# EasyEDA Pro project ProPrj_TPA3156_EASYEDA.epro, schematic Schematic1
Board Name: Board1; Create Date: 2024-09-04; Page Name: P1; Project Name: TPA3156 Amplifire; Schematic Name: Schematic1; Update Date: 2024-09-26; Company: EasyEDA.com; Drawn: EasyEDA; Page Size: A4; Part Number: JLCPCB-002; Reviewed: EasyEDA; Version: V0.1
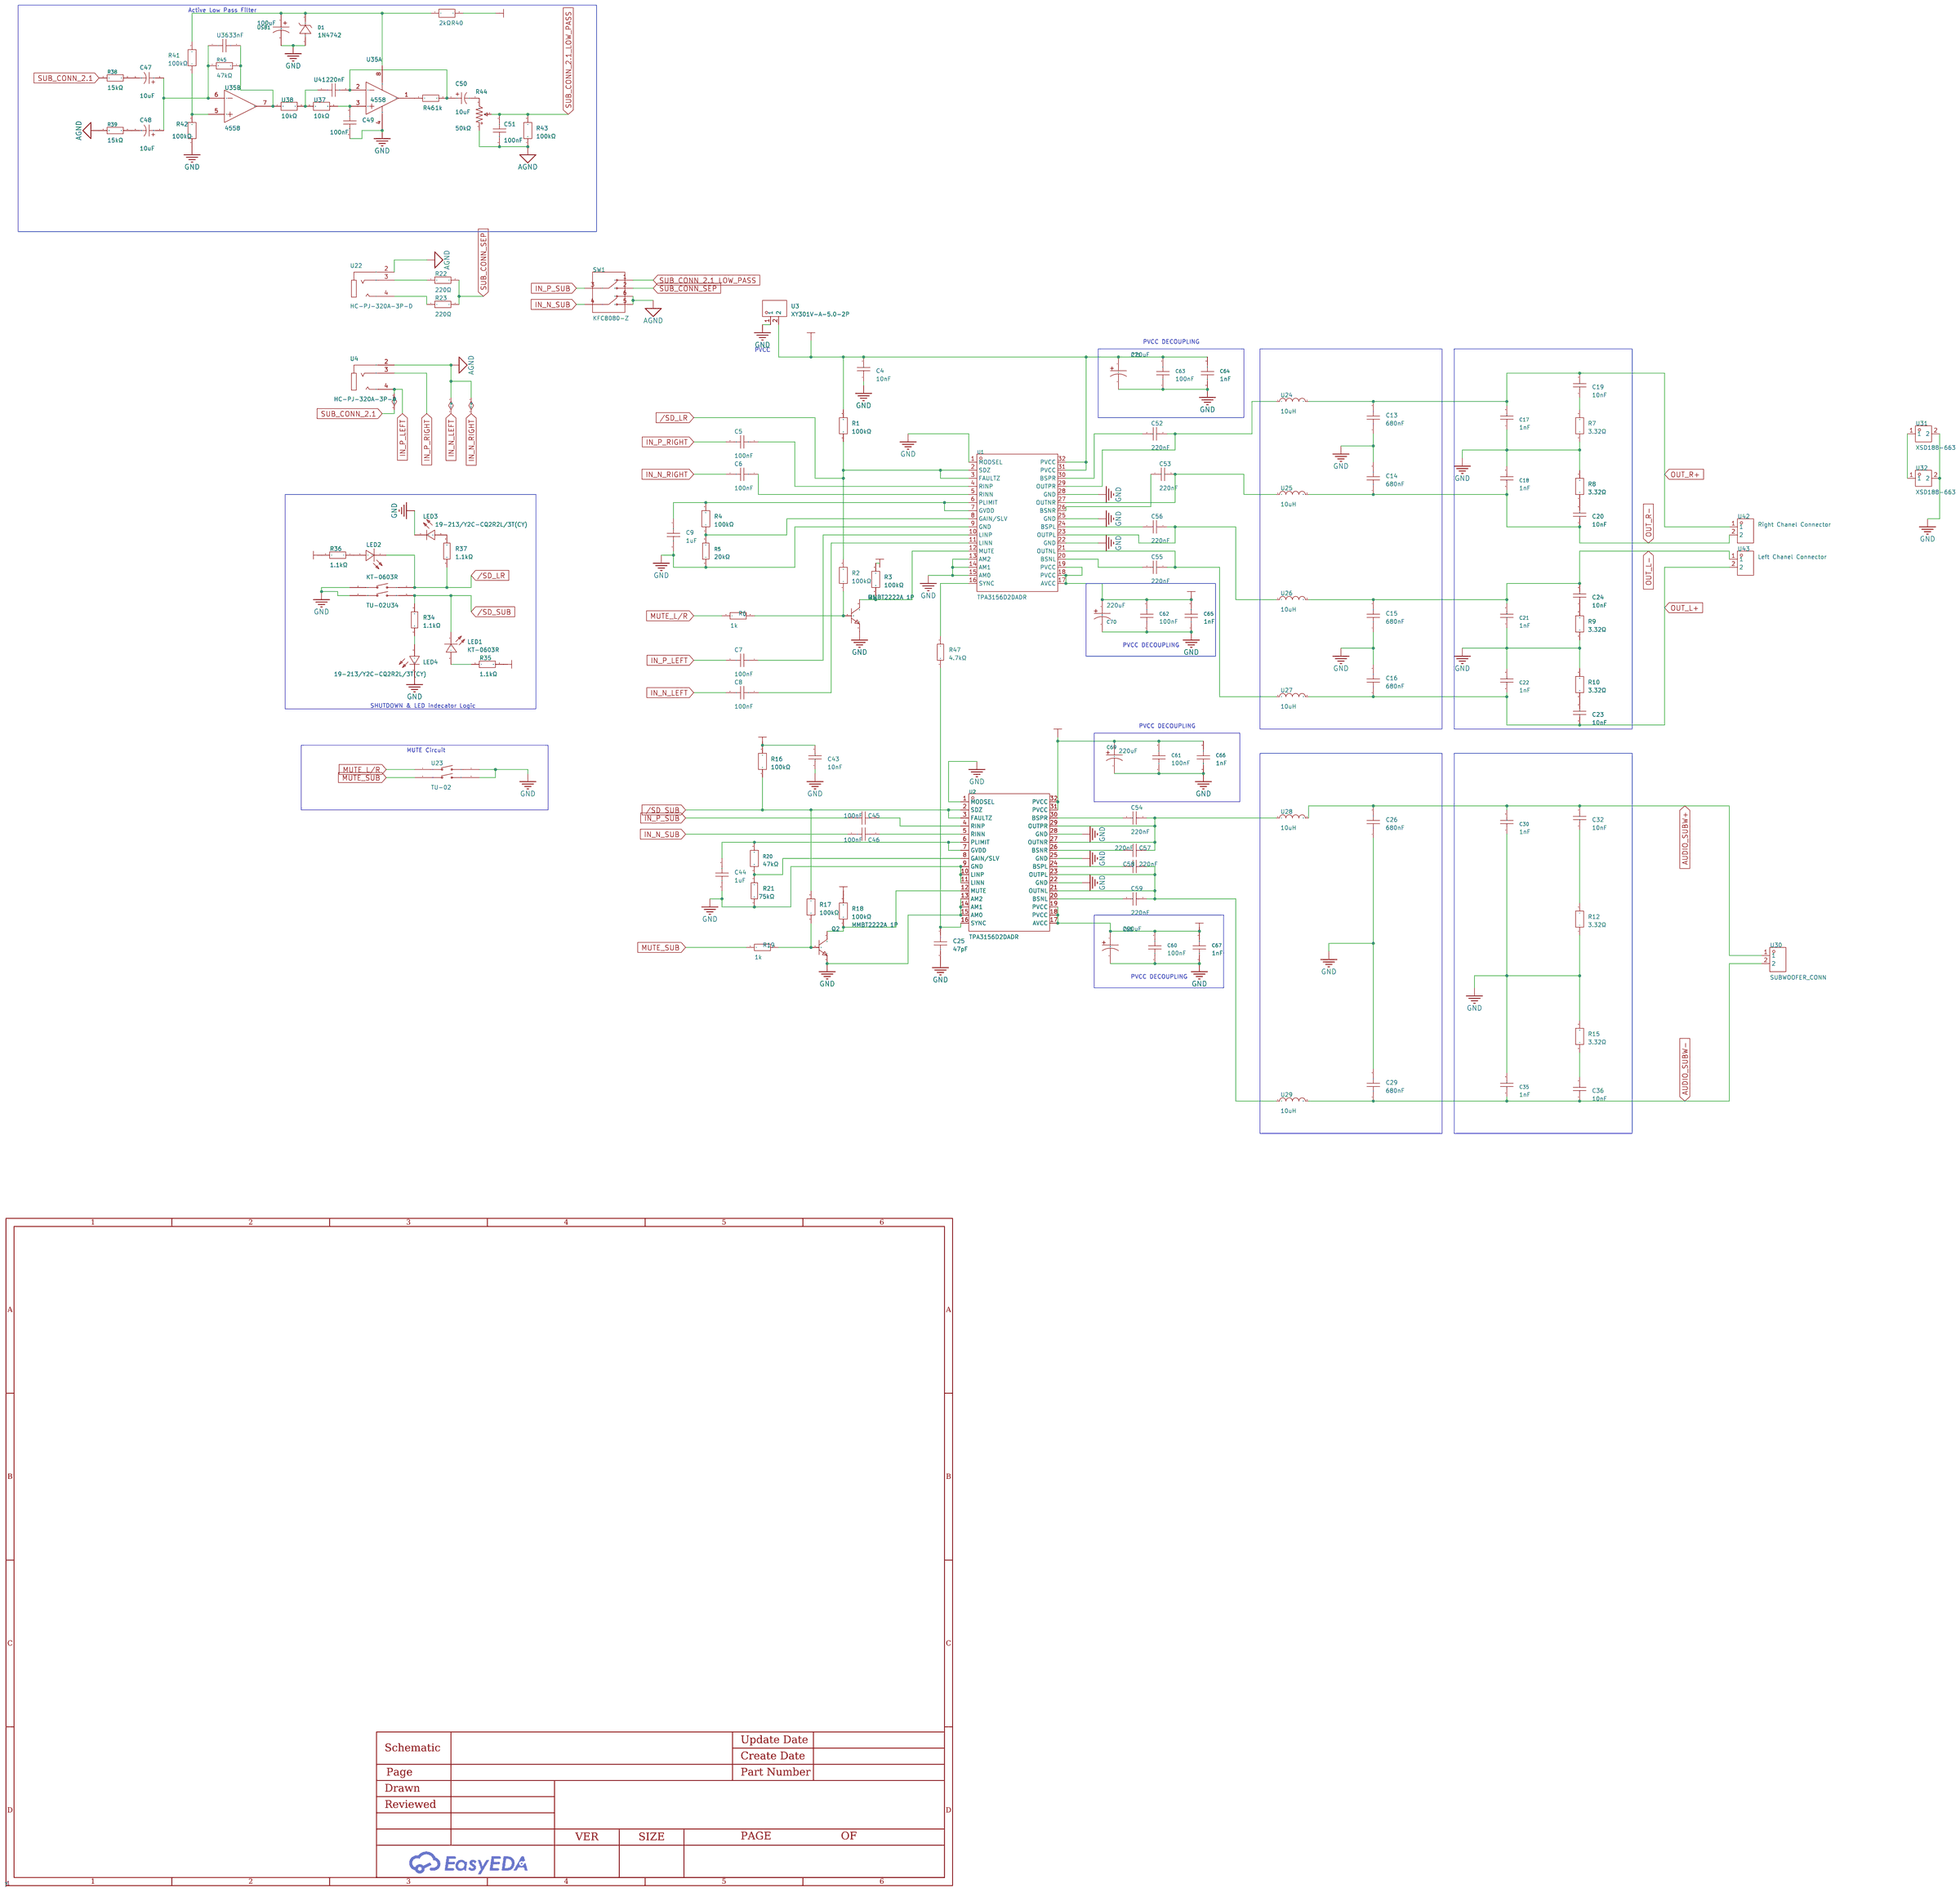
[diagram p0: schematic sheet]

## Parts
C4  10nF  [C0805]
C5  100nF  [C0603]
C6  100nF  [C0603]
C7  100nF  [C0603]
C8  100nF  [C0603]
C9  1uF  [C0603]
C13  680nF  [C1206]
C14  680nF  [C1206]
C15  680nF  [C1206]
C16  680nF  [C1206]
C17  1nF  [C0603]
C18  1nF  [C0603]
C19  10nF  [C0805]
C20  10nF  [C0805]
C21  1nF  [C0603]
C22  1nF  [C0603]
C23  10nF  [C0805]
C24  10nF  [C0805]
C25  47pF  [C0201]
C26  680nF  [C1206]
C29  680nF  [C1206]
C30  1nF  [C0603]
C32  10nF  [C0805]
C35  1nF  [C0603]
C36  10nF  [C0805]
C43  10nF  [C0805]
C44  1uF  [C0603]
C45  100nF  [C0603]
C46  100nF  [C0603]
C47  10uF  [CAP-SMD_L2.0-W1.3-FD]
C48  10uF  [CAP-SMD_L2.0-W1.3-FD]
C49  100nF  [C0603]
C50  10uF  [CAP-SMD_L2.0-W1.3-FD]
C51  100nF  [C0603]
C52  220nF  [C0603]
C53  220nF  [C0603]
C54  220nF  [C0603]
C55  220nF  [C0603]
C56  220nF  [C0603]
C57  220nF  [C0603]
C58  220nF  [C0603]
C59  220nF  [C0603]
C60  100nF  [C0603]
C61  100nF  [C0603]
C62  100nF  [C0603]
C63  100nF  [C0603]
C64  1nF  [C0603]
C65  1nF  [C0603]
C66  1nF  [C0603]
C67  1nF  [C0603]
C68  220uF  [CAP-TH_BD10.0-P5.00-D1.0-FD]
C69  220uF  [CAP-TH_BD10.0-P5.00-D1.0-FD]
C70  220uF  [CAP-TH_BD10.0-P5.00-D1.0-FD]
C71  220uF  [CAP-TH_BD10.0-P5.00-D1.0-FD]
D1  1N4742  [DO-41_BD2.4-L4.7-P8.70-D0.8-FD]
LED1  KT-0603R  [LED0603-RD]
LED2  KT-0603R  [LED0603-RD]
LED3  19-213/Y2C-CQ2R2L/3T(CY)  [LED0603-RD-YELLOW]
LED4  19-213/Y2C-CQ2R2L/3T(CY)  [LED0603-RD-YELLOW]
Q1  MMBT2222A 1P  [SOT-23-3_L2.9-W1.3-P1.90-LS2.4-BR]
Q2  MMBT2222A 1P  [SOT-23-3_L2.9-W1.3-P1.90-LS2.4-BR]
R1  100kΩ  [R1206]
R2  100kΩ  [R1206]
R3  100kΩ  [R1206]
R4  100kΩ  [R1206]
R5  20kΩ  [R0603]
R6  1k  [R0603]
R7  3.32Ω  [R0201]
R8  3.32Ω  [R0201]
R9  3.32Ω  [R0201]
R10  3.32Ω  [R0201]
R12  3.32Ω  [R0201]
R15  3.32Ω  [R0201]
R16  100kΩ  [R1206]
R17  100kΩ  [R1206]
R18  100kΩ  [R1206]
R19  1k  [R0603]
R20  47kΩ  [R0805]
R21  75kΩ  [R0805]
R22  220Ω  [R0805]
R23  220Ω  [R0805]
R34  1.1kΩ  [R0603]
R35  1.1kΩ  [R0603]
R36  1.1kΩ  [R0603]
R37  1.1kΩ  [R0603]
R38  15kΩ  [R0402]
R39  15kΩ  [R0402]
R40  2kΩ  [R0805]
R41  100kΩ  [R0805]
R42  100kΩ  [R0805]
R43  100kΩ  [R0805]
R44  50kΩ  [RES-ADJ-TH_3P-L9.5-W4.85-P2.50-BL-BS]
R45  47kΩ  [R0603]
R46  1k  [R0603]
R47  4.7kΩ  [R0402]
SW1  KFC8080-Z  [SW-TH_6P-L8.0-W8.0-P2.50]
U1  TPA3156D2DADR  [HTSSOP-32_L11.0-W6.1-P0.65-LS8.1-BL]
U2  TPA3156D2DADR  [HTSSOP-32_L11.0-W6.1-P0.65-LS8.1-BL]
U3  XY301V-A-5.0-2P  [CONN-TH_XY301V-A-5.0-2P]
U4  HC-PJ-320A-3P-D  [AUDIO-TH_HC-PJ-320A-3P-D]
U22  HC-PJ-320A-3P-D  [AUDIO-TH_HC-PJ-320A-3P-D]
U23  TU-02  [SW-SMD_4P-P1.27-L4.2-W5.4]
U24  10uH  [IND-SMD_L13.2-W12.9_MMD-12FD]
U25  10uH  [IND-SMD_L13.2-W12.9_MMD-12FD]
U26  10uH  [IND-SMD_L13.2-W12.9_MMD-12FD]
U27  10uH  [IND-SMD_L13.2-W12.9_MMD-12FD]
U28  10uH  [IND-SMD_L13.2-W12.9_MMD-12FD]
U29  10uH  [IND-SMD_L13.2-W12.9_MMD-12FD]
U30  SUBWOOFER_CONN  [CONN-TH_XY301V-A-5.0-2P]
U31  XSD188-663  [HEATSINK-SMD_XSD188-663]
U32  XSD188-663  [HEATSINK-SMD_XSD188-663]
U34  TU-02  [SW-SMD_4P-P1.27-L4.2-W5.4]
U35  4558  [SOP-8_L5.0-W4.0-P1.27-LS6.0-BL]  (sections 1,2)
U36  33nF  [C0402]
U37  10kΩ  [R0603]
U38  10kΩ  [R0603]
U41  220nF  [C0201]
U42  Right Chanel Connector  [CONN-TH_XY301V-A-5.0-2P]
U43  Left Chanel Connector  [CONN-TH_XY301V-A-5.0-2P]
USB1  100uF  [CAP-TH_BD8.0-P3.50-D0.6-FD_1]

## Library data of the parts
C4 C19 C20 C23 C24 C32 C36 C43 = CL21B103KBANNNC: Capacitance: Tolerance:±10% Tolerance:±10% Voltage Rated: Temperature Coefficient:; LCSC Part Name: 10nF ±10% 50V; Supplier Part: C1710; Manufacturer: SAMSUNG(三星); Supplier Footprint: 0805; JLCPCB Part Class: Basic Part; Datasheet: https://atta.szlcsc.com/upload/public/pdf/source/20160218/1457707763339.pdf; Supplier: LCSC; Tolerance: ±10%
C5-C9 C44-C46 C49 C51 = CAP_0603: Supplier Footprint: 0603
C13-C16 C26 C29 = 12065C684KAT2A: Capacitance: Tolerance:±10% Tolerance:±10% Voltage Rated: Temperature Coefficient:; LCSC Part Name: 680nF ±10% 50V; Supplier Part: C597526; Manufacturer: Kyocera AVX; Supplier Footprint: 1206; JLCPCB Part Class: Extended Part; Datasheet: https://atta.szlcsc.com/upload/public/pdf/source/20200615/C597466_43C0ECAE328FD9290913677CF18D6AC0.pdf; Supplier: LCSC; Tolerance: ±10%
C17 C18 C21 C22 C30 C35 = CL10B102KB8NNNC: Capacitance: Tolerance:±10% Tolerance:±10% Voltage Rated: Temperature Coefficient:; LCSC Part Name: 1nF ±10% 50V; Supplier Part: C1588; Manufacturer: SAMSUNG(三星); Supplier Footprint: 0603; Datasheet: https://atta.szlcsc.com/upload/public/pdf/source/20160218/1457707763339.pdf; Supplier: LCSC; Tolerance: ±10%
C25 = C0603C0G1E470J030BA: Capacitance: Tolerance:±5% Tolerance:±5% Voltage Rated: Temperature Coefficient:; LCSC Part Name: 47pF ±5% 25V; Supplier Part: C2182698; Manufacturer: TDK; Supplier Footprint: 0201; JLCPCB Part Class: Extended Part; Datasheet: https://atta.szlcsc.com/upload/public/pdf/source/20210430/12912E3792F621391F28022904E5A4A4.pdf; Supplier: LCSC; Tolerance: ±5%
C47 C48 C50 = CA45A-P-6.3V-10UF-K: Capacitance: Tolerance:±10% Tolerance:±10% Rated Voltage: Operating Temperature:-55℃~+125℃ Operating Temperature:-55℃~+125℃; LCSC Part Name: 10uF ±10% 6.3V; Supplier Part: C2976905; Manufacturer: CEC(振华新云); Supplier Footprint: SMD,1.25x2mm; JLCPCB Part Class: Extended Part; Datasheet: https://atta.szlcsc.com/upload/public/pdf/source/20220222/C2C5F368BEBB90E653B4407F98E5644A.pdf; Supplier: LCSC; Tolerance: ±10%; Operating Temperature: -55℃~+125℃
C52-C59 = GRM188R71E224KA88D: Capacitance: Tolerance:±10% Tolerance:±10% Voltage Rated: Temperature Coefficient:; LCSC Part Name: 220nF ±10% 25V; Supplier Part: C77051; Manufacturer: muRata(村田); Supplier Footprint: 0603; Datasheet: https://atta.szlcsc.com/upload/public/pdf/source/20200305/C490387_23319AE8C154DEB24C505E6C82A8106A.pdf; Supplier: LCSC; Tolerance: ±10%
C60-C63 = GCM188R71H104KA57D: Capacitance: Tolerance:±10% Tolerance:±10% Voltage Rated: Temperature Coefficient:; LCSC Part Name: 100nF ±10% 50V; Supplier Part: C85864; Manufacturer: muRata(村田); Supplier Footprint: 0603; JLCPCB Part Class: Extended Part; Datasheet: https://atta.szlcsc.com/upload/public/pdf/source/20161104/1478252919844.pdf; Supplier: LCSC; Tolerance: ±10%
C64-C67 = GRM1885C1H102JA01D: Capacitance: Tolerance:±5% Tolerance:±5% Voltage Rated: Temperature Coefficient:; LCSC Part Name: 1nF ±5% 50V; Supplier Part: C77026; Manufacturer: muRata(村田); Supplier Footprint: 0603; JLCPCB Part Class: Extended Part; Datasheet: https://atta.szlcsc.com/upload/public/pdf/source/20200305/C490387_23319AE8C154DEB24C505E6C82A8106A.pdf; Supplier: LCSC; Tolerance: ±5%
C68-C71 = EEUFC1V221B: Capacitance: Tolerance:±20% Tolerance:±20% Rated Voltage: Ripple Current:755mA@100kHz Equivalent Series Resistance(ESR):90mΩ@100kHz Lead Spacing: φD: L: Lifetime @ Temp:3000hrs@105℃ Operating Temperature:-55℃~+105℃ Operating Temperature:-55℃~+105℃; LCSC Part Name: 220uF ±20% 35V; Supplier Part: C178681; Manufacturer: PANASONIC(松下); Supplier Footprint: 插件,D10xL12.5mm; JLCPCB Part Class: Extended Part; Datasheet: https://atta.szlcsc.com/upload/public/pdf/source/20181222/C178681_6E15EF82E6D495A72D0777BE3B4ACA7A.pdf; Supplier: LCSC; Tolerance: ±20%; Ripple Current: 755mA@100kHz; Equivalent Series Resistance(ESR): 90mΩ@100kHz; Lifetime @ Temp: 3000hrs@105℃; Operating Temperature: -55℃~+105℃
D1 = 1N4742: Diode Configuration:Single Zener Voltage (Nom):12V Reverse Leakage Current (Ir):3uA Zener Voltage (Range):11.45V~12.95V Zener Voltage (Range):11.45V~12.95V Power Dissipation:1W Zener Impedance (Zzt):9Ω Tolerance:±5% Tolerance:±5%; Supplier Part: C5174492; Manufacturer: LGE(鲁光); Supplier Footprint: DO-41; JLCPCB Part Class: Extended Part; Datasheet: https://atta.szlcsc.com/upload/public/pdf/source/20220915/859F92BB52C22EFA9D12B90684DCEAFE.pdf; Supplier: LCSC; Diode Configuration: Single; Zener Voltage (Nom): 12V; Reverse Leakage Current (Ir): 3uA; Zener Voltage (Range): 11.45V~12.95V; Power Dissipation: 1W; Zener Impedance (Zzt): 9Ω; Tolerance: ±5%
LED1 LED2 = KT-0603R: Emitted Color:Red Power Dissipation:- Forward Current:- Dominant Wavelength:- Dominant Wavelength:- Peak Wavelength:- Diode Configuration:- Lens Color:- Color Temperature:- Color Temperature:- Viewing Angle:- Mounting Sytle:- Operating Temperature:-40℃~+8; LCSC Part Name: 0603 红灯 高亮; Supplier Part: C2286; Manufacturer: KENTO; Supplier Footprint: 0603; JLCPCB Part Class: Basic Part; Datasheet: https://atta.szlcsc.com/upload/public/pdf/source/20160616/1466072038404.pdf; Supplier: LCSC; Emitted Color: Red; Operating Temperature: -40℃~+85℃
LED3 LED4 = 19-213/Y2C-CQ2R2L/3T(CY): Emitted Color:Yellow Power Dissipation:60mW Forward Current:20mA Dominant Wavelength:585.5nm~591.5nm Dominant Wavelength:585.5nm~591.5nm Peak Wavelength:591nm Diode Configuration:- Lens Color:无色透明透镜 Color Temperature:- Color Temperature:- Viewing Angle:12; LCSC Part Name: 黄灯; Supplier Part: C72038; Manufacturer: EVERLIGHT(亿光); Supplier Footprint: 0603; JLCPCB Part Class: Basic Part; Datasheet: https://atta.szlcsc.com/upload/public/pdf/source/20160507/1462613613586.pdf; Supplier: LCSC; Emitted Color: Yellow; Power Dissipation: 60mW; Forward Current: 20mA; Dominant Wavelength: 585.5nm~591.5nm; Peak Wavelength: 591nm; Lens Color: 无色透明透镜; Viewing Angle: 120°; Operating Temperature: -40℃~+85℃
Q1 Q2 = MMBT2222A 1P: Transistor Type: Collector Current (Ic): Collector-Emitter Breakdown Voltage (Vceo): Power Dissipation (Pd): Transition Frequency (fT):300MHz Collector Cut-Off Current (Icbo):10nA Collector-Emitter Saturation Voltage (VCE(sat)@Ic,Ib):1V@500mA,50mA Operati; LCSC Part Name: NPN 电流:600mA 耐压:40V 丝印1P; Supplier Part: C8512; Manufacturer: CJ(江苏长电/长晶); Supplier Footprint: SOT-23; JLCPCB Part Class: Basic Part; Datasheet: https://atta.szlcsc.com/upload/public/pdf/source/20140815/1457707223705.pdf; Supplier: LCSC; Transition Frequency (fT): 300MHz; Collector Cut-Off Current (Icbo): 10nA; Collector-Emitter Saturation Voltage (VCE(sat)@Ic,Ib): 1V@500mA,50mA
R1-R4 R16-R18 = RNCS1206BKE100K: Type:Thin Film Resistor Resistance: Tolerance:±0.1% Tolerance:±0.1% Power(Watts): Overload Voltage (Max): Temperature Coefficient:±25ppm/℃ Temperature Coefficient:±25ppm/℃ Operating Temperature Range:-55℃~+155℃ Operating Temperature Range:-55℃~+155℃; LCSC Part Name: 薄膜电阻 100kΩ ±0.1% 125mW; Supplier Part: C346663; Manufacturer: SEI(Stackpole Electronics Inc.); Supplier Footprint: 1206; JLCPCB Part Class: Extended Part; Datasheet: https://atta.szlcsc.com/upload/public/pdf/source/20190312/C346690_015790D0191F715BE190A3F714156E39.pdf; Supplier: LCSC; Type: Thin Film Resistor; Tolerance: ±0.1%; Temperature Coefficient: ±25ppm/℃; Operating Temperature Range: -55℃~+155℃
R5 = 0603WAF2002T5E: Type:Thick Film Resistors Resistance:20kΩ Tolerance:±1% Tolerance:±1% Power(Watts): Overload Voltage (Max): Temperature Coefficient:±100ppm/℃ Temperature Coefficient:±100ppm/℃ Operating Temperature Range:-55℃~+155℃ Operating Temperature Range:-55℃~+155℃; LCSC Part Name: 20kΩ ±1% 100mW 厚膜电阻; Supplier Part: C4184; Manufacturer: UNI-ROYAL(厚声); Supplier Footprint: 0603; Datasheet: https://atta.szlcsc.com/upload/public/pdf/source/20200306/C422600_1E6D84923E4A46A82E41ADD87F860B5C.pdf; Supplier: LCSC; Type: Thick Film Resistors; Tolerance: ±1%; Temperature Coefficient: ±100ppm/℃; Operating Temperature Range: -55℃~+155℃
R6 R19 R46 = Res_0603: Supplier Footprint: 0603
R7-R10 R12 R15 = 0201WMF332KTEE: Type:Thick Film Resistors Resistance:3320mΩ Tolerance:±1% Tolerance:±1% Power(Watts): Overload Voltage (Max): Temperature Coefficient:-100ppm/℃~+350ppm/℃ Temperature Coefficient:-100ppm/℃~+350ppm/℃ Operating Temperature Range:-55℃~+155℃ Operating Temperat; LCSC Part Name: 3.32Ω ±1% 50mW 厚膜电阻; Supplier Part: C423576; Manufacturer: UNI-ROYAL(厚声); Supplier Footprint: 0201; Datasheet: https://atta.szlcsc.com/upload/public/pdf/source/20200306/C422600_1E6D84923E4A46A82E41ADD87F860B5C.pdf; Supplier: LCSC; Type: Thick Film Resistors; Tolerance: ±1%; Temperature Coefficient: -100ppm/℃~+350ppm/℃; Operating Temperature Range: -55℃~+155℃
R20 = ERA6VEB4702V: Type:Thin Film Resistor Resistance:47kΩ Tolerance:±0.1% Tolerance:±0.1% Power(Watts): Temperature Coefficient:±25ppm/℃ Temperature Coefficient:±25ppm/℃ Operating Temperature Range:-55℃~+155℃ Operating Temperature Range:-55℃~+155℃; LCSC Part Name: 47kΩ ±0.1% 250mW 薄膜电阻; Supplier Part: C490805; Manufacturer: PANASONIC(松下); Supplier Footprint: 0805; JLCPCB Part Class: Extended Part; Datasheet: https://atta.szlcsc.com/upload/public/pdf/source/20200407/C490805_3A20CAE3CE075CA1D6BE6B79E40105B5.pdf; Supplier: LCSC; Type: Thin Film Resistor; Tolerance: ±0.1%; Temperature Coefficient: ±25ppm/℃; Operating Temperature Range: -55℃~+155℃
R21 = RT0805BRD0775KL: Type:Thin Film Resistor Resistance: Tolerance:±0.1% Tolerance:±0.1% Power(Watts): Overload Voltage (Max): Temperature Coefficient:±25ppm/℃ Temperature Coefficient:±25ppm/℃ Operating Temperature Range:-55℃~+155℃ Operating Temperature Range:-55℃~+155℃; LCSC Part Name: 薄膜电阻 75kΩ ±0.1% 125mW; Supplier Part: C136919; Manufacturer: YAGEO(国巨); Supplier Footprint: 0805; JLCPCB Part Class: Extended Part; Datasheet: https://atta.szlcsc.com/upload/public/pdf/source/20181009/C309664_C7CEF5A7F4D0541F96EF5E54D941D229.pdf; Supplier: LCSC; Type: Thin Film Resistor; Tolerance: ±0.1%; Temperature Coefficient: ±25ppm/℃; Operating Temperature Range: -55℃~+155℃
R22 R23 = RN732ATTD2200B25: Type:Thin Film Resistor Resistance: Tolerance:±0.1% Tolerance:±0.1% Power(Watts): Overload Voltage (Max): Temperature Coefficient:±25ppm/℃ Temperature Coefficient:±25ppm/℃ Operating Temperature Range:-55℃~+155℃ Operating Temperature Range:-55℃~+155℃; LCSC Part Name: 薄膜电阻 220Ω ±0.1% 100mW; Supplier Part: C186460; Manufacturer: KOA; Supplier Footprint: 0805; JLCPCB Part Class: Extended Part; Datasheet: https://atta.szlcsc.com/upload/public/pdf/source/20180829/C273634_2FADC9C33DD9A7D2212AAB53F51E1632.pdf; Supplier: LCSC; Type: Thin Film Resistor; Tolerance: ±0.1%; Temperature Coefficient: ±25ppm/℃; Operating Temperature Range: -55℃~+155℃
R34-R37 = RN73H1JTTD1101B25: Type:Metal Film Resistors Resistance: Tolerance:±0.1% Tolerance:±0.1% Power(Watts): Overload Voltage (Max): Temperature Coefficient:±25ppm/℃ Temperature Coefficient:±25ppm/℃ Operating Temperature Range:-55℃~+155℃ Operating Temperature Range:-55℃~+155℃; LCSC Part Name: 金属膜电阻 1.1kΩ ±0.1% 100mW; Supplier Part: C186187; Manufacturer: KOA; Supplier Footprint: 0603; JLCPCB Part Class: Extended Part; Datasheet: https://atta.szlcsc.com/upload/public/pdf/source/20180504/C186301_C27E1BE5F8243F699B52B606AD6FD604.pdf; Supplier: LCSC; Type: Metal Film Resistors; Tolerance: ±0.1%; Temperature Coefficient: ±25ppm/℃; Operating Temperature Range: -55℃~+155℃
R38 R39 = TR0402F15K0Q1050Z: Type:Thin Film Resistor Resistance: Tolerance:±1% Tolerance:±1% Power(Watts): Overload Voltage (Max): Temperature Coefficient:±50ppm/℃ Temperature Coefficient:±50ppm/℃ Operating Temperature Range:-55℃~+155℃ Operating Temperature Range:-55℃~+155℃; LCSC Part Name: 薄膜电阻 15kΩ ±1% 63mW; Supplier Part: C149917; Manufacturer: EVER OHMS(天二科技); Supplier Footprint: 0402; JLCPCB Part Class: Extended Part; Datasheet: https://atta.szlcsc.com/upload/public/pdf/source/20190527/C149900_32B1354086E9F6A772108AB7B2B7A514.pdf; Supplier: LCSC; Type: Thin Film Resistor; Tolerance: ±1%; Temperature Coefficient: ±50ppm/℃; Operating Temperature Range: -55℃~+155℃
R40 = RN73H2ATTD2001B10: Type:Metal Film Resistors Resistance: Tolerance:±0.1% Tolerance:±0.1% Power(Watts): Temperature Coefficient:±10ppm/℃ Temperature Coefficient:±10ppm/℃ Operating Temperature Range:-55℃~+155℃ Operating Temperature Range:-55℃~+155℃; LCSC Part Name: 金属膜电阻 2kΩ ±0.1% 125mW; Supplier Part: C782235; Manufacturer: KOA; Supplier Footprint: 0805; JLCPCB Part Class: Extended Part; Datasheet: https://atta.szlcsc.com/upload/public/pdf/source/20200909/C782235_A96C5D75DAB930F25D533550B4CBE346.pdf; Supplier: LCSC; Type: Metal Film Resistors; Tolerance: ±0.1%; Temperature Coefficient: ±10ppm/℃; Operating Temperature Range: -55℃~+155℃
R41-R43 = RTAN0805BKE100K: Type:Thin Film Resistor Resistance: Tolerance:±0.1% Tolerance:±0.1% Power(Watts): Overload Voltage (Max): Temperature Coefficient:±25ppm/℃ Temperature Coefficient:±25ppm/℃ Operating Temperature Range:-55℃~+155℃ Operating Temperature Range:-55℃~+155℃; LCSC Part Name: 薄膜电阻 100kΩ ±0.1% 200mW; Supplier Part: C346756; Manufacturer: SEI(Stackpole Electronics Inc.); Supplier Footprint: 0805; Datasheet: https://atta.szlcsc.com/upload/public/pdf/source/20190409/C346762_CF6A9804CCBC7C818068AFEC4224D226.pdf; Supplier: LCSC; Type: Thin Film Resistor; Tolerance: ±0.1%; Temperature Coefficient: ±25ppm/℃; Operating Temperature Range: -55℃~+155℃
R44 = 3296W-1-503: Resistance: Tolerance:±10% Tolerance:±10%; LCSC Part Name: 50kΩ ±10%; Supplier Part: C118911; Manufacturer: BOCHEN(博晨); Supplier Footprint: 插件; JLCPCB Part Class: Extended Part; Datasheet: https://atta.szlcsc.com/upload/public/pdf/source/20171114/C118911_15106326557211117401.pdf; Supplier: LCSC; Tolerance: ±10%
R45 = 0603WAJ0473T5E: Type:Thick Film Resistors Resistance:47kΩ Tolerance:±5% Tolerance:±5% Power(Watts): Overload Voltage (Max): Temperature Coefficient:±100ppm/℃ Temperature Coefficient:±100ppm/℃ Operating Temperature Range:-55℃~+155℃ Operating Temperature Range:-55℃~+155℃; LCSC Part Name: 47kΩ ±5% 100mW 厚膜电阻; Supplier Part: C25600; Manufacturer: UNI-ROYAL(厚声); Supplier Footprint: 0603; JLCPCB Part Class: Extended Part; Datasheet: https://atta.szlcsc.com/upload/public/pdf/source/20200306/C422600_1E6D84923E4A46A82E41ADD87F860B5C.pdf; Supplier: LCSC; Type: Thick Film Resistors; Tolerance: ±5%; Temperature Coefficient: ±100ppm/℃; Operating Temperature Range: -55℃~+155℃
R47 = RN731ETTP4701B25: Type:Thin Film Resistor Resistance: Tolerance:±0.1% Tolerance:±0.1% Power(Watts): Overload Voltage (Max): Temperature Coefficient:±25ppm/℃ Temperature Coefficient:±25ppm/℃ Operating Temperature Range:-55℃~+155℃ Operating Temperature Range:-55℃~+155℃; LCSC Part Name: 薄膜电阻 4.7kΩ ±0.1% 63mW; Supplier Part: C186341; Manufacturer: KOA; Supplier Footprint: 0402; JLCPCB Part Class: Extended Part; Datasheet: https://atta.szlcsc.com/upload/public/pdf/source/20180829/C273634_2FADC9C33DD9A7D2212AAB53F51E1632.pdf; Supplier: LCSC; Type: Thin Film Resistor; Tolerance: ±0.1%; Temperature Coefficient: ±25ppm/℃; Operating Temperature Range: -55℃~+155℃
SW1 = KFC8080-Z: Supplier Part: C22459512; Manufacturer: HanElectricity(瀚源); Supplier Footprint: DIP-6P,8x8mm; Datasheet: https://atta.szlcsc.com/upload/public/pdf/source/20240605/DC71B89AEAD00466DFED731966B72BAC.pdf; Supplier: LCSC
U1 U2 = TPA3156D2DADR: Type of Power Amplifier: Output Power:; Supplier Part: C469879; Manufacturer: TI(德州仪器); Supplier Footprint: HTSSOP-32-6.1mm; JLCPCB Part Class: Extended Part; Datasheet: https://www.ti.com/cn/lit/gpn/tpa3156d2; Supplier: LCSC
U3 U30 U42 U43 = XY301V-A-5.0-2P: Structure:1x2P Pitch:5mm Color:Blue Mounting Style:Straight Current Rating (Max):15A Voltage Rating (Max):300V Number of Pins:2P Number of Rows:1 Wire Gauge - AWG:14~22 Wire Gauge - AWG:14~22 Wire Gauge - mm2:1.5 Wire Gauge - mm2:1.5 Number of PINs Per Ro; LCSC Part Name: 1x2P 5mm 直插 排数:1 每排P数:2; Supplier Part: C557651; Manufacturer: XINLAIYA(新莱亚); Supplier Footprint: 插件,P=5mm; JLCPCB Part Class: Extended Part; Datasheet: https://atta.szlcsc.com/upload/public/pdf/source/20200527/C557652_0563DB88D69D1781C63AEA43A3E9DCA1.pdf; Supplier: LCSC; Structure: 1x2P; Pitch: 5mm; Color: Blue; Mounting Style: Straight; Current Rating (Max): 15A; Voltage Rating (Max): 300V; Number of Pins: 2P; Number of Rows: 1; Wire Gauge - AWG: 14~22; Wire Gauge - mm2: 1.5; Number of PINs Per Row: 2; Contact Material: Copper; Contact Plating: Tin; Screw Specification: M2.5
U4 U22 = HC-PJ-320A-3P-D: Connector Type:3.5mm Headphone Jack Current Rating (Max):500mA Voltage Rating (Max):30V Contact Material:Phosphor Bronze Contact Plating:Silver Operating Temperature Range:-25℃~+70℃ Operating Temperature Range:-25℃~+70℃; LCSC Part Name: 3.5mm耳机座; Supplier Part: C5372850; Manufacturer: HCTL(华灿天禄); Supplier Footprint: 插件; JLCPCB Part Class: Extended Part; Datasheet: https://atta.szlcsc.com/upload/public/pdf/source/20230320/4A8881E1470B66944C23DDFE28325D61.pdf; Supplier: LCSC; Connector Type: 3.5mm Headphone Jack; Current Rating (Max): 500mA; Voltage Rating (Max): 30V; Contact Material: Phosphor Bronze; Contact Plating: Silver; Operating Temperature Range: -25℃~+70℃
U23 U34 = TU-02: Type:平拨,凹槽式 Number of Positions:2Bit Lead Pitch:1.27mm; LCSC Part Name: 间距1.27mm平拨凹槽式包脚2位拨码开关; Supplier Part: C7419812; Manufacturer: Yuandi(元迪); Supplier Footprint: SMD; JLCPCB Part Class: Extended Part; Datasheet: https://atta.szlcsc.com/upload/public/pdf/source/20230621/741DBB29A54E61C74AF0A9FEC729909C.pdf; Supplier: LCSC; Type: 平拨,凹槽式; Number of Positions: 2Bit; Lead Pitch: 1.27mm
U24-U29 = IHLP5050CEER100M01: Inductance: Tolerance:±20% Tolerance:±20% Rated Current: Saturation Current (Isat):14A DC Resistance (DCR):30.4mΩ Type:一体成型电感 Ratings:-; LCSC Part Name: 10uH ±20% 14A; Supplier Part: C845087; Manufacturer: VISHAY(威世); Supplier Footprint: SMD,12.9x13.2mm; Datasheet: https://atta.szlcsc.com/upload/public/pdf/source/20220429/EC6009124C811F0D04CB73AD899698F3.pdf; Supplier: LCSC; Tolerance: ±20%; Saturation Current (Isat): 14A; DC Resistance (DCR): 30.4mΩ; Type: 一体成型电感
U31 U32 = XSD188-663: ProductSize:35*35*14MM Colour:Black TextureOfMaterial:6063-T5铝 SurfaceTreatment:氧化黑色 Shape:- NumberOfHoles:- NumberOfTeeth:- NumberOfNails:- SpringBuckle:- type:- Thermal conductivity:- working temperature:- Flame retardant:- specifications:- density:- ha; LCSC Part Name: 35*35*14MM黑色开槽双针; Supplier Part: C286208; Manufacturer: XSD(鑫顺达); JLCPCB Part Class: Extended Part; Datasheet: https://atta.szlcsc.com/upload/public/pdf/source/20180927/C286208_AC4C3DE9DB16D2B5B5A9877957E9ED94.pdf; Supplier: LCSC; ProductSize: 35*35*14MM; Colour: Black; TextureOfMaterial: 6063-T5铝; SurfaceTreatment: 氧化黑色
U35 = 4558: Number of Circuits:; Supplier Part: C478986; Manufacturer: PUOLOP(迪浦); Supplier Footprint: SOP-8; JLCPCB Part Class: Extended Part; Datasheet: https://atta.szlcsc.com/upload/public/pdf/source/20200106/C478986_9BF7DC3F2F4B4A3BC7AA3D2B5758586A.pdf; Supplier: LCSC
U36 = CGA2B3X7R1H333K050BB: Capacitance: Tolerance:±10% Tolerance:±10% Voltage Rated: Temperature Coefficient:; LCSC Part Name: 33nF ±10% 50V; Supplier Part: C2168662; Manufacturer: TDK; Supplier Footprint: 0402; JLCPCB Part Class: Extended Part; Datasheet: https://atta.szlcsc.com/upload/public/pdf/source/20210430/BD8671736ED62E65BA506F30C3AAED50.pdf; Supplier: LCSC; Tolerance: ±10%
U37 U38 = TP0603T10K0P0510Z: Type:Thin Film Resistor Resistance: Tolerance:±0.01% Tolerance:±0.01% Temperature Coefficient:±10ppm/℃ Temperature Coefficient:±10ppm/℃ Operating Temperature Range:-55℃~+155℃ Operating Temperature Range:-55℃~+155℃; LCSC Part Name: 薄膜电阻 10kΩ ±0.01%; Supplier Part: C5184132; Manufacturer: EVER OHMS(天二科技); Supplier Footprint: 0603; JLCPCB Part Class: Extended Part; Datasheet: https://atta.szlcsc.com/upload/public/pdf/source/20221114/33623788AE25E42A5D888FF02D01F9C5.pdf; Supplier: LCSC; Type: Thin Film Resistor; Tolerance: ±0.01%; Temperature Coefficient: ±10ppm/℃; Operating Temperature Range: -55℃~+155℃
U41 = C0603X5R1E224M030BC: Capacitance: Tolerance:±20% Tolerance:±20% Voltage Rated: Temperature Coefficient:; LCSC Part Name: 220nF ±20% 25V; Supplier Part: C3839743; Manufacturer: TDK; Supplier Footprint: 0201; JLCPCB Part Class: Extended Part; Datasheet: https://atta.szlcsc.com/upload/public/pdf/source/20230606/A83975C7E70EF5AFCD4A17254ABD78F2.pdf; Supplier: LCSC; Tolerance: ±20%
USB1 = B41866C5107M000: Capacitance: Tolerance:±20% Tolerance:±20% Rated Voltage: Ripple Current:297mA@100kHz Equivalent Series Resistance(ESR):646mΩ@10kHz Lead Spacing: φD: L: Lifetime @ Temp:2000hrs@125℃; LCSC Part Name: 100uF ±20% 25V; Supplier Part: C1593413; Manufacturer: TDK; Supplier Footprint: 插件,D8xL11.5mm; JLCPCB Part Class: Extended Part; Datasheet: https://atta.szlcsc.com/upload/public/pdf/source/20200417/C515209_24A434C5993516B82F922E3FD706B92C.pdf; Supplier: LCSC; Tolerance: ±20%; Ripple Current: 297mA@100kHz; Equivalent Series Resistance(ESR): 646mΩ@10kHz; Lifetime @ Temp: 2000hrs@125℃

## Nets
AGND: C6.2 C8.2 C51.2 R39.1 R43.1 R44.1 SW1.5 SW1.6 U4.2 U22.2
GND: C4.1 C9.2 C13.1 C14.2 C15.1 C16.2 C17.1 C18.2 C21.1 C22.2 C25.2 C26.1 C29.2 C30.1 C35.2 C43.1 C44.2 C49.2 C60.1 C61.1 C62.1 C63.1 C64.1 C65.1 C66.1 C67.1 C68.2 C69.2 C70.2 C71.2 D1.1(A) LED3.1(C) LED4.1(C) Q1.2(E) Q2.2(E) R5.1 R7.1 R8.2 R9.1 R10.2 R12.1 R15.2 R21.1 R42.1 U1.1(MODSEL) U1.9(GND) U1.13(AM2) U1.14(AM1) U1.15(AM0) U1.22(GND) U1.25(GND) U1.28(GND) U2.1(MODSEL) U2.9(GND) U2.10(LINP) U2.11(LINN) U2.13(AM2) U2.14(AM1) U2.15(AM0) U2.22(GND) U2.25(GND) U2.28(GND) U3.1 U23.3 U23.4 U31.2 U32.2 U34.1 U34.2 U35.4(VEE) USB1.2
PVCC: C4.2 C43.2 C60.2 C61.2 C62.2 C63.2 C64.2 C65.2 C66.2 C67.2 C68.1 C69.1 C70.1 C71.1 R1.2 R3.2 R16.2 R18.2 R35.2 R36.2 R40.2 U1.17(AVCC) U1.18(PVCC) U1.19(PVCC) U1.31(PVCC) U1.32(PVCC) U2.17(AVCC) U2.18(PVCC) U2.19(PVCC) U2.31(PVCC) U2.32(PVCC) U3.2
/SD_LR: LED2.1(K) R1.1 R2.2 R37.1 U1.2(SDZ) U1.3(FAULTZ) U34.4
/SD_SUB: LED1.1(K) R16.1 R17.2 R34.1 U2.2(SDZ) U2.3(FAULTZ) U34.3
AUDIO_SUBW+: C26.2 C30.2 C32.2 U28.2 U30.1
AUDIO_SUBW-: C29.1 C35.1 C36.1 U29.2 U30.2
IN_N_SUB: C46.2 SW1.4
IN_P_LEFT: C7.2 R38.1 U4.4
IN_P_RIGHT: C5.2 U4.3
IN_P_SUB: C45.2 SW1.3
MUTE_L/R: R6.1 U23.1
MUTE_SUB: R19.1 U23.2
OUT_L+: C16.1 C22.1 C23.1 U27.2 U43.2
OUT_L-: C15.2 C21.2 C24.2 U26.2 U43.1
OUT_R+: C13.2 C17.2 C19.2 U24.2 U42.1
OUT_R-: C14.1 C18.1 C20.1 U25.2 U42.2
SUB_CONN_2.1_LOW_PASS: C51.1 R43.2 R44.2 SW1.1
SUB_CONN_SEP: R22.2 R23.2 SW1.2
$1N1782: Q1.3(C) R3.1 U1.12(MUTE)
$1N2014: Q1.1(B) R2.1 R6.2
$1N2219: C5.1 U1.4(RINP)
$1N2228: C6.1 U1.5(RINN)
$1N2235: C7.1 U1.10(LINP)
$1N2241: C8.1 U1.11(LINN)
$1N2940: R4.1 R5.2 U1.8(GAIN/SLV)
$1N2981: C9.1 R4.2 U1.6(PLIMIT) U1.7(GVDD)
$1N3797: C52.1 U1.30(BSPR)
$1N3803: C52.2 U1.29(OUTPR) U24.1
$1N3963: C56.1 U1.24(BSPL)
$1N3967: C56.2 U1.23(OUTPL) U26.1
$1N3975: C55.1 U1.20(BSNL)
$1N3982: C55.2 U1.21(OUTNL) U27.1
$1N4001: C53.1 U1.26(BSNR)
$1N4006: C53.2 U1.27(OUTNR) U25.1
$1N4665: C19.1 R7.2
$1N4702: C20.2 R8.1
$1N4989: C23.2 R10.1
$1N5053: C24.1 R9.2
$1N6437: R47.1 U1.16(SYNC)
$1N6442: C25.1 R47.2 U2.16(SYNC)
$1N7467: C36.2 R15.1
$1N8160: C54.1 U2.30(BSPR)
$1N8164: C57.1 U2.26(BSNR)
$1N8169: C58.1 U2.24(BSPL)
$1N8174: C59.1 U2.20(BSNL)
$1N8240: C54.2 C57.2 U2.27(OUTNR) U2.29(OUTPR) U28.1
$1N8252: C58.2 C59.2 U2.21(OUTNL) U2.23(OUTPL) U29.1
$1N11098: Q2.3(C) R18.1 U2.12(MUTE)
$1N11099: Q2.1(B) R17.1 R19.2
$1N11392: C44.1 R20.2 U2.6(PLIMIT) U2.7(GVDD)
$1N11394: R20.1 R21.2 U2.8(GAIN/SLV)
$1N11527: C45.1 U2.4(RINP)
$1N11533: C46.1 U2.5(RINN)
$1N12103: R22.1 U22.3
$1N12107: R23.1 U22.4
$1N17569: U31.1 U32.1
$1N22357: C32.1 R12.2
$1N36466: LED4.2(A) R34.2
$1N36468: LED1.2(A) R35.1
$1N36477: LED2.2(A) R36.1
$1N36525: LED3.2(A) R37.2
$1N39804: C47.2 R38.2
$1N39840: C48.2 R39.2
$1N40769: D1.2(K) R40.1 R41.2 U35.8(VCC) USB1.1
$1N40894: C49.1 U35.3(IN+) U37.2
$1N40897: U37.1 U38.2 U41.1
$1N40933: C50.1 R46.2 U35.2(IN-) U41.2
$1N41118: R46.1 U35.1(OUT)
$1N41167: C50.2 R44.3
$1N41301: R41.1 R42.2 U35.5(IN+)
$1N41306: C47.1 C48.1 R45.2 U35.6(IN-) U36.1
$1N41351: R45.1 U35.7(OUT) U36.2 U38.1

## Notes on the sheet
- Active Low Pass Filter
- PVCC
- PVCC DECOUPLING
- PVCC DECOUPLING
- SHUTDOWN & LED indecator Logic
- PVCC DECOUPLING
- MUTE Circuit
- PVCC DECOUPLING
